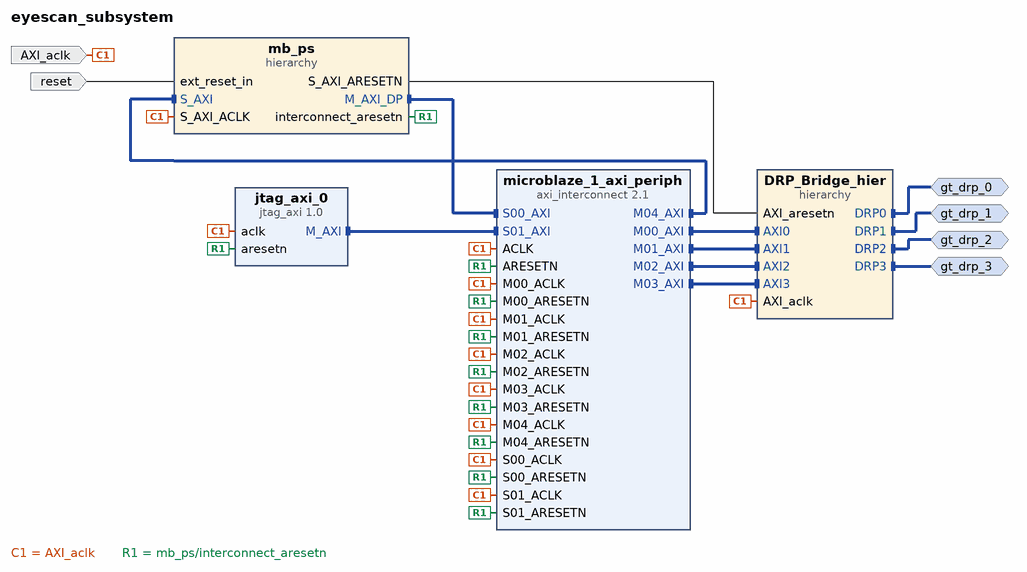
[diagram p0: block diagram of the top level]
# Vivado block design eyescan_subsystem, Vivado 2014.4
create_bd_design eyescan_subsystem

create_bd_intf_port -mode Master -vlnv xilinx.com:interface:drp_rtl:1.0 gt_drp_0
create_bd_intf_port -mode Master -vlnv xilinx.com:interface:drp_rtl:1.0 gt_drp_1
create_bd_intf_port -mode Master -vlnv xilinx.com:interface:drp_rtl:1.0 gt_drp_2
create_bd_intf_port -mode Master -vlnv xilinx.com:interface:drp_rtl:1.0 gt_drp_3
create_bd_port -dir I AXI_aclk
create_bd_port -dir I -type rst reset
set_property -dict {CONFIG.POLARITY ACTIVE_HIGH} [get_bd_ports reset]

create_bd_cell -type hier DRP_Bridge_hier
create_bd_cell -type hier mb_ps
create_bd_cell -type ip -vlnv xilinx.com:ip:jtag_axi:1.0 jtag_axi_0
create_bd_cell -type ip -vlnv xilinx.com:ip:axi_interconnect:2.1 microblaze_1_axi_periph
set_property -dict {CONFIG.NUM_SI 2 CONFIG.NUM_MI 5 CONFIG.STRATEGY 1} [get_bd_cells microblaze_1_axi_periph]

# ---- hierarchy /DRP_Bridge_hier ----
current_bd_instance /DRP_Bridge_hier
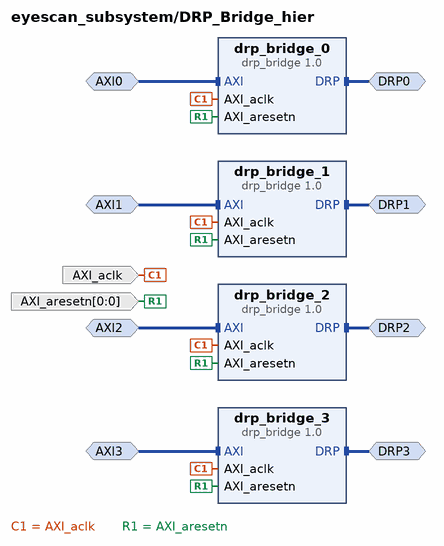
[diagram p1: block diagram inside /DRP_Bridge_hier]
create_bd_intf_pin -mode Slave -vlnv xilinx.com:interface:aximm_rtl:1.0 AXI0
create_bd_intf_pin -mode Slave -vlnv xilinx.com:interface:aximm_rtl:1.0 AXI1
create_bd_intf_pin -mode Slave -vlnv xilinx.com:interface:aximm_rtl:1.0 AXI2
create_bd_intf_pin -mode Slave -vlnv xilinx.com:interface:aximm_rtl:1.0 AXI3
create_bd_intf_pin -mode Master -vlnv xilinx.com:interface:drp_rtl:1.0 DRP0
create_bd_intf_pin -mode Master -vlnv xilinx.com:interface:drp_rtl:1.0 DRP1
create_bd_intf_pin -mode Master -vlnv xilinx.com:interface:drp_rtl:1.0 DRP2
create_bd_intf_pin -mode Master -vlnv xilinx.com:interface:drp_rtl:1.0 DRP3
create_bd_pin -dir I -type clk AXI_aclk
create_bd_pin -dir I -from 0 -to 0 -type rst AXI_aresetn

create_bd_cell -type ip -vlnv xilinx.com:ip:drp_bridge:1.0 drp_bridge_0
set_property -dict {CONFIG.C_S_AXI_ADDR_WIDTH 24} [get_bd_cells drp_bridge_0]
create_bd_cell -type ip -vlnv xilinx.com:ip:drp_bridge:1.0 drp_bridge_1
set_property -dict {CONFIG.C_S_AXI_ADDR_WIDTH 24} [get_bd_cells drp_bridge_1]
create_bd_cell -type ip -vlnv xilinx.com:ip:drp_bridge:1.0 drp_bridge_2
set_property -dict {CONFIG.C_S_AXI_ADDR_WIDTH 24} [get_bd_cells drp_bridge_2]
create_bd_cell -type ip -vlnv xilinx.com:ip:drp_bridge:1.0 drp_bridge_3
set_property -dict {CONFIG.C_S_AXI_ADDR_WIDTH 24} [get_bd_cells drp_bridge_3]

# ---- hierarchy /mb_ps ----
current_bd_instance /mb_ps
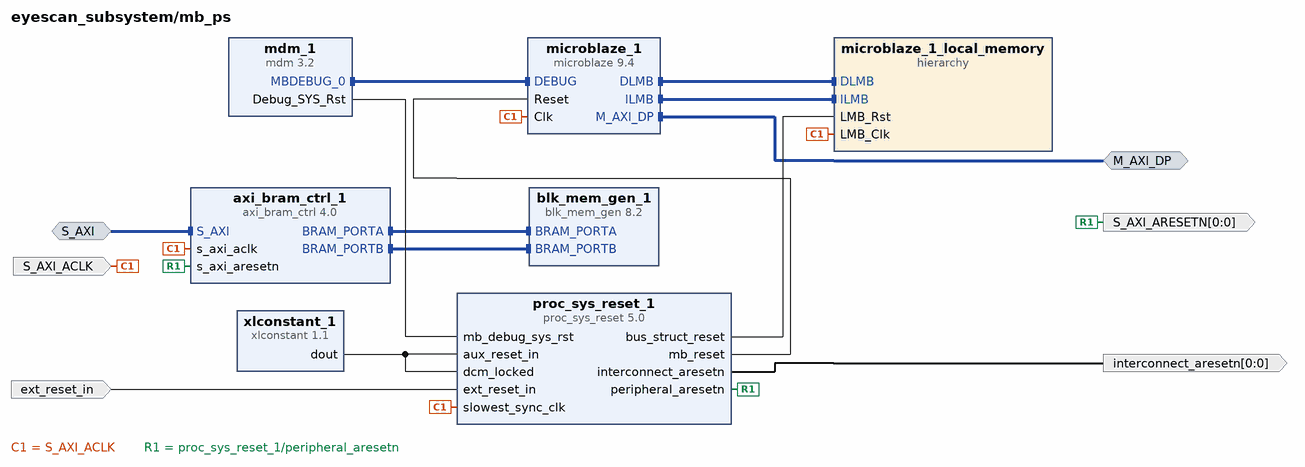
[diagram p2: block diagram inside /mb_ps]
create_bd_intf_pin -mode Master -vlnv xilinx.com:interface:aximm_rtl:1.0 M_AXI_DP
create_bd_intf_pin -mode Slave -vlnv xilinx.com:interface:aximm_rtl:1.0 S_AXI
create_bd_pin -dir I -type clk S_AXI_ACLK
create_bd_pin -dir O -from 0 -to 0 -type rst S_AXI_ARESETN
create_bd_pin -dir I -type rst ext_reset_in
create_bd_pin -dir O -from 0 -to 0 -type rst interconnect_aresetn

create_bd_cell -type hier microblaze_1_local_memory
create_bd_cell -type ip -vlnv xilinx.com:ip:axi_bram_ctrl:4.0 axi_bram_ctrl_1
set_property -dict {CONFIG.SUPPORTS_NARROW_BURST 0} [get_bd_cells axi_bram_ctrl_1]
create_bd_cell -type ip -vlnv xilinx.com:ip:blk_mem_gen:8.2 blk_mem_gen_1
set_property -dict [list \
  CONFIG.Memory_Type True_Dual_Port_RAM \
  CONFIG.Enable_32bit_Address true \
  CONFIG.Enable_B Use_ENB_Pin \
  CONFIG.Register_PortA_Output_of_Memory_Primitives false \
  CONFIG.Use_RSTA_Pin true \
  CONFIG.Use_RSTB_Pin true \
  CONFIG.Port_B_Clock 100 \
  CONFIG.Port_B_Write_Rate 50 \
  CONFIG.Port_B_Enable_Rate 100 \
  CONFIG.use_bram_block BRAM_Controller \
] [get_bd_cells blk_mem_gen_1]
create_bd_cell -type ip -vlnv xilinx.com:ip:mdm:3.2 mdm_1
create_bd_cell -type ip -vlnv xilinx.com:ip:microblaze:9.4 microblaze_1
set_property -dict [list \
  CONFIG.C_FREQ 100000000 \
  CONFIG.C_FAULT_TOLERANT 0 \
  CONFIG.C_AREA_OPTIMIZED 1 \
  CONFIG.C_D_AXI 1 \
  CONFIG.C_D_LMB 1 \
  CONFIG.C_I_LMB 1 \
  CONFIG.C_M_AXI_DC_USER_SIGNALS 0 \
  CONFIG.C_M_AXI_IC_USER_SIGNALS 0 \
  CONFIG.G_TEMPLATE_LIST 1 \
  CONFIG.C_USE_REORDER_INSTR 0 \
  CONFIG.C_DEBUG_ENABLED 1 \
  CONFIG.C_NUMBER_OF_PC_BRK 0 \
  CONFIG.C_USE_INTERRUPT 0 \
  CONFIG.C_USE_EXT_BRK 0 \
  CONFIG.C_USE_EXT_NM_BRK 0 \
] [get_bd_cells microblaze_1]
create_bd_cell -type ip -vlnv xilinx.com:ip:proc_sys_reset:5.0 proc_sys_reset_1
set_property -dict {CONFIG.C_AUX_RESET_HIGH 0 CONFIG.USE_BOARD_FLOW false} [get_bd_cells proc_sys_reset_1]
create_bd_cell -type ip -vlnv xilinx.com:ip:xlconstant:1.1 xlconstant_1

# ---- hierarchy /mb_ps/microblaze_1_local_memory ----
current_bd_instance /mb_ps/microblaze_1_local_memory
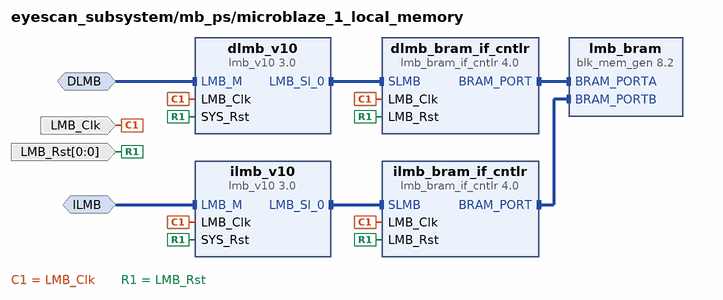
[diagram p3: block diagram inside /mb_ps/microblaze_1_local_memory]
create_bd_intf_pin -mode MirroredMaster -vlnv xilinx.com:interface:lmb_rtl:1.0 DLMB
create_bd_intf_pin -mode MirroredMaster -vlnv xilinx.com:interface:lmb_rtl:1.0 ILMB
create_bd_pin -dir I LMB_Clk
create_bd_pin -dir I -from 0 -to 0 LMB_Rst

create_bd_cell -type ip -vlnv xilinx.com:ip:lmb_bram_if_cntlr:4.0 dlmb_bram_if_cntlr
set_property -dict {CONFIG.C_MASK 0x40000000 CONFIG.C_ECC 0} [get_bd_cells dlmb_bram_if_cntlr]
create_bd_cell -type ip -vlnv xilinx.com:ip:lmb_v10:3.0 dlmb_v10
create_bd_cell -type ip -vlnv xilinx.com:ip:lmb_bram_if_cntlr:4.0 ilmb_bram_if_cntlr
set_property -dict {CONFIG.C_MASK 0x00000000 CONFIG.C_ECC 0} [get_bd_cells ilmb_bram_if_cntlr]
create_bd_cell -type ip -vlnv xilinx.com:ip:lmb_v10:3.0 ilmb_v10
create_bd_cell -type ip -vlnv xilinx.com:ip:blk_mem_gen:8.2 lmb_bram
set_property -dict [list \
  CONFIG.Memory_Type True_Dual_Port_RAM \
  CONFIG.Enable_32bit_Address true \
  CONFIG.Enable_B Use_ENB_Pin \
  CONFIG.Register_PortA_Output_of_Memory_Primitives false \
  CONFIG.Use_RSTA_Pin true \
  CONFIG.Use_RSTB_Pin true \
  CONFIG.Port_B_Clock 100 \
  CONFIG.Port_B_Write_Rate 50 \
  CONFIG.Port_B_Enable_Rate 100 \
  CONFIG.use_bram_block BRAM_Controller \
] [get_bd_cells lmb_bram]

# ---- connections ----

current_bd_instance /DRP_Bridge_hier
connect_bd_intf_net [get_bd_intf_pins AXI0] [get_bd_intf_pins drp_bridge_0/AXI]
connect_bd_intf_net [get_bd_intf_pins AXI1] [get_bd_intf_pins drp_bridge_1/AXI]
connect_bd_intf_net [get_bd_intf_pins AXI2] [get_bd_intf_pins drp_bridge_2/AXI]
connect_bd_intf_net [get_bd_intf_pins AXI3] [get_bd_intf_pins drp_bridge_3/AXI]
connect_bd_intf_net -intf_net drp_mux_1_gt_drp [get_bd_intf_pins DRP0] [get_bd_intf_pins drp_bridge_0/DRP]
connect_bd_intf_net -intf_net drp_mux_2_gt_drp [get_bd_intf_pins DRP1] [get_bd_intf_pins drp_bridge_1/DRP]
connect_bd_intf_net -intf_net drp_mux_3_gt_drp [get_bd_intf_pins DRP2] [get_bd_intf_pins drp_bridge_2/DRP]
connect_bd_intf_net -intf_net drp_bridge_4_drp [get_bd_intf_pins DRP3] [get_bd_intf_pins drp_bridge_3/DRP]
connect_bd_net [get_bd_pins AXI_aclk] \
  [get_bd_pins drp_bridge_0/AXI_aclk] [get_bd_pins drp_bridge_1/AXI_aclk] [get_bd_pins drp_bridge_2/AXI_aclk] \
  [get_bd_pins drp_bridge_3/AXI_aclk]
connect_bd_net -net proc_sys_reset_1_peripheral_aresetn [get_bd_pins AXI_aresetn] \
  [get_bd_pins drp_bridge_0/AXI_aresetn] [get_bd_pins drp_bridge_1/AXI_aresetn] [get_bd_pins drp_bridge_2/AXI_aresetn] \
  [get_bd_pins drp_bridge_3/AXI_aresetn]

current_bd_instance /mb_ps
connect_bd_intf_net [get_bd_intf_pins axi_bram_ctrl_1/BRAM_PORTA] [get_bd_intf_pins blk_mem_gen_1/BRAM_PORTA]
connect_bd_intf_net [get_bd_intf_pins axi_bram_ctrl_1/BRAM_PORTB] [get_bd_intf_pins blk_mem_gen_1/BRAM_PORTB]
connect_bd_intf_net [get_bd_intf_pins mdm_1/MBDEBUG_0] [get_bd_intf_pins microblaze_1/DEBUG]
connect_bd_intf_net [get_bd_intf_pins microblaze_1/DLMB] [get_bd_intf_pins microblaze_1_local_memory/DLMB]
connect_bd_intf_net [get_bd_intf_pins microblaze_1/ILMB] [get_bd_intf_pins microblaze_1_local_memory/ILMB]
connect_bd_intf_net -intf_net microblaze_1_axi_dp [get_bd_intf_pins M_AXI_DP] [get_bd_intf_pins microblaze_1/M_AXI_DP]
connect_bd_intf_net [get_bd_intf_pins S_AXI] [get_bd_intf_pins axi_bram_ctrl_1/S_AXI]
connect_bd_net -net axi_aclk_1 [get_bd_pins S_AXI_ACLK] \
  [get_bd_pins microblaze_1_local_memory/LMB_Clk] [get_bd_pins axi_bram_ctrl_1/s_axi_aclk] [get_bd_pins microblaze_1/Clk] \
  [get_bd_pins proc_sys_reset_1/slowest_sync_clk]
connect_bd_net -net m07_aresetn_1 [get_bd_pins proc_sys_reset_1/interconnect_aresetn] [get_bd_pins interconnect_aresetn]
connect_bd_net [get_bd_pins mdm_1/Debug_SYS_Rst] [get_bd_pins proc_sys_reset_1/mb_debug_sys_rst]
connect_bd_net [get_bd_pins proc_sys_reset_1/bus_struct_reset] [get_bd_pins microblaze_1_local_memory/LMB_Rst]
connect_bd_net [get_bd_pins proc_sys_reset_1/mb_reset] [get_bd_pins microblaze_1/Reset]
connect_bd_net [get_bd_pins proc_sys_reset_1/peripheral_aresetn] [get_bd_pins S_AXI_ARESETN] [get_bd_pins axi_bram_ctrl_1/s_axi_aresetn]
connect_bd_net -net reset_1 [get_bd_pins ext_reset_in] [get_bd_pins proc_sys_reset_1/ext_reset_in]
connect_bd_net -net xlconstant_1_const [get_bd_pins xlconstant_1/dout] \
  [get_bd_pins proc_sys_reset_1/aux_reset_in] [get_bd_pins proc_sys_reset_1/dcm_locked]

current_bd_instance /mb_ps/microblaze_1_local_memory
connect_bd_intf_net -intf_net microblaze_1_dlmb_bus [get_bd_intf_pins dlmb_bram_if_cntlr/SLMB] [get_bd_intf_pins dlmb_v10/LMB_Sl_0]
connect_bd_intf_net -intf_net microblaze_1_dlmb_cntlr [get_bd_intf_pins dlmb_bram_if_cntlr/BRAM_PORT] [get_bd_intf_pins lmb_bram/BRAM_PORTA]
connect_bd_intf_net -intf_net microblaze_1_ilmb_bus [get_bd_intf_pins ilmb_bram_if_cntlr/SLMB] [get_bd_intf_pins ilmb_v10/LMB_Sl_0]
connect_bd_intf_net -intf_net microblaze_1_ilmb_cntlr [get_bd_intf_pins ilmb_bram_if_cntlr/BRAM_PORT] [get_bd_intf_pins lmb_bram/BRAM_PORTB]
connect_bd_intf_net -intf_net microblaze_1_dlmb [get_bd_intf_pins DLMB] [get_bd_intf_pins dlmb_v10/LMB_M]
connect_bd_intf_net -intf_net microblaze_1_ilmb [get_bd_intf_pins ILMB] [get_bd_intf_pins ilmb_v10/LMB_M]
connect_bd_net -net microblaze_1_Clk [get_bd_pins LMB_Clk] \
  [get_bd_pins dlmb_bram_if_cntlr/LMB_Clk] [get_bd_pins dlmb_v10/LMB_Clk] [get_bd_pins ilmb_bram_if_cntlr/LMB_Clk] \
  [get_bd_pins ilmb_v10/LMB_Clk]
connect_bd_net -net proc_sys_reset_1_bus_struct_reset [get_bd_pins LMB_Rst] \
  [get_bd_pins dlmb_bram_if_cntlr/LMB_Rst] [get_bd_pins dlmb_v10/SYS_Rst] [get_bd_pins ilmb_bram_if_cntlr/LMB_Rst] \
  [get_bd_pins ilmb_v10/SYS_Rst]

current_bd_instance /
connect_bd_intf_net [get_bd_intf_pins jtag_axi_0/M_AXI] [get_bd_intf_pins microblaze_1_axi_periph/S01_AXI]
connect_bd_intf_net -intf_net microblaze_1_axi_dp [get_bd_intf_pins mb_ps/M_AXI_DP] [get_bd_intf_pins microblaze_1_axi_periph/S00_AXI]
connect_bd_intf_net -intf_net AXI0_1 [get_bd_intf_pins DRP_Bridge_hier/AXI0] [get_bd_intf_pins microblaze_1_axi_periph/M00_AXI]
connect_bd_intf_net -intf_net AXI1_1 [get_bd_intf_pins DRP_Bridge_hier/AXI1] [get_bd_intf_pins microblaze_1_axi_periph/M01_AXI]
connect_bd_intf_net -intf_net AXI2_1 [get_bd_intf_pins DRP_Bridge_hier/AXI2] [get_bd_intf_pins microblaze_1_axi_periph/M02_AXI]
connect_bd_intf_net -intf_net AXI3_1 [get_bd_intf_pins DRP_Bridge_hier/AXI3] [get_bd_intf_pins microblaze_1_axi_periph/M03_AXI]
connect_bd_intf_net [get_bd_intf_pins microblaze_1_axi_periph/M04_AXI] [get_bd_intf_pins mb_ps/S_AXI]
connect_bd_intf_net -intf_net drp_mux_1_gt_drp [get_bd_intf_ports gt_drp_0] [get_bd_intf_pins DRP_Bridge_hier/DRP0]
connect_bd_intf_net -intf_net drp_mux_2_gt_drp [get_bd_intf_ports gt_drp_1] [get_bd_intf_pins DRP_Bridge_hier/DRP1]
connect_bd_intf_net -intf_net drp_mux_3_gt_drp [get_bd_intf_ports gt_drp_2] [get_bd_intf_pins DRP_Bridge_hier/DRP2]
connect_bd_intf_net -intf_net drp_bridge_4_drp [get_bd_intf_ports gt_drp_3] [get_bd_intf_pins DRP_Bridge_hier/DRP3]
connect_bd_net [get_bd_ports AXI_aclk] \
  [get_bd_pins DRP_Bridge_hier/AXI_aclk] [get_bd_pins mb_ps/S_AXI_ACLK] [get_bd_pins jtag_axi_0/aclk] \
  [get_bd_pins microblaze_1_axi_periph/ACLK] [get_bd_pins microblaze_1_axi_periph/S00_ACLK] \
  [get_bd_pins microblaze_1_axi_periph/M00_ACLK] [get_bd_pins microblaze_1_axi_periph/M01_ACLK] \
  [get_bd_pins microblaze_1_axi_periph/S01_ACLK] [get_bd_pins microblaze_1_axi_periph/M02_ACLK] \
  [get_bd_pins microblaze_1_axi_periph/M03_ACLK] [get_bd_pins microblaze_1_axi_periph/M04_ACLK]
connect_bd_net -net m07_aresetn_1 [get_bd_pins mb_ps/interconnect_aresetn] \
  [get_bd_pins jtag_axi_0/aresetn] [get_bd_pins microblaze_1_axi_periph/ARESETN] \
  [get_bd_pins microblaze_1_axi_periph/S00_ARESETN] [get_bd_pins microblaze_1_axi_periph/M00_ARESETN] \
  [get_bd_pins microblaze_1_axi_periph/M01_ARESETN] [get_bd_pins microblaze_1_axi_periph/S01_ARESETN] \
  [get_bd_pins microblaze_1_axi_periph/M02_ARESETN] [get_bd_pins microblaze_1_axi_periph/M03_ARESETN] \
  [get_bd_pins microblaze_1_axi_periph/M04_ARESETN]
connect_bd_net -net proc_sys_reset_1_peripheral_aresetn [get_bd_pins mb_ps/S_AXI_ARESETN] [get_bd_pins DRP_Bridge_hier/AXI_aresetn]
connect_bd_net [get_bd_ports reset] [get_bd_pins mb_ps/ext_reset_in]

# ---- address map ----
assign_bd_address -offset 0xC0000000 -range 4K -target_address_space [get_bd_addr_spaces jtag_axi_0/Data] [get_bd_addr_segs DRP_Bridge_hier/drp_bridge_0/AXI/reg0]
assign_bd_address -offset 0xC0001000 -range 4K -target_address_space [get_bd_addr_spaces jtag_axi_0/Data] [get_bd_addr_segs DRP_Bridge_hier/drp_bridge_1/AXI/reg0]
assign_bd_address -offset 0xC0002000 -range 4K -target_address_space [get_bd_addr_spaces jtag_axi_0/Data] [get_bd_addr_segs DRP_Bridge_hier/drp_bridge_2/AXI/reg0]
assign_bd_address -offset 0xC0003000 -range 4K -target_address_space [get_bd_addr_spaces jtag_axi_0/Data] [get_bd_addr_segs DRP_Bridge_hier/drp_bridge_3/AXI/reg0]
assign_bd_address -offset 0xC2000000 -range 16K -target_address_space [get_bd_addr_spaces jtag_axi_0/Data] [get_bd_addr_segs mb_ps/axi_bram_ctrl_1/S_AXI/Mem0]
assign_bd_address -offset 0x0 -range 16K -target_address_space [get_bd_addr_spaces mb_ps/microblaze_1/Data] [get_bd_addr_segs mb_ps/microblaze_1_local_memory/dlmb_bram_if_cntlr/SLMB/Mem]
assign_bd_address -offset 0xC0000000 -range 4K -target_address_space [get_bd_addr_spaces mb_ps/microblaze_1/Data] [get_bd_addr_segs DRP_Bridge_hier/drp_bridge_0/AXI/reg0]
assign_bd_address -offset 0xC0001000 -range 4K -target_address_space [get_bd_addr_spaces mb_ps/microblaze_1/Data] [get_bd_addr_segs DRP_Bridge_hier/drp_bridge_1/AXI/reg0]
assign_bd_address -offset 0xC0002000 -range 4K -target_address_space [get_bd_addr_spaces mb_ps/microblaze_1/Data] [get_bd_addr_segs DRP_Bridge_hier/drp_bridge_2/AXI/reg0]
assign_bd_address -offset 0xC0003000 -range 4K -target_address_space [get_bd_addr_spaces mb_ps/microblaze_1/Data] [get_bd_addr_segs DRP_Bridge_hier/drp_bridge_3/AXI/reg0]
assign_bd_address -offset 0xC2000000 -range 16K -target_address_space [get_bd_addr_spaces mb_ps/microblaze_1/Data] [get_bd_addr_segs mb_ps/axi_bram_ctrl_1/S_AXI/Mem0]
assign_bd_address -offset 0x0 -range 16K -target_address_space [get_bd_addr_spaces mb_ps/microblaze_1/Instruction] [get_bd_addr_segs mb_ps/microblaze_1_local_memory/ilmb_bram_if_cntlr/SLMB/Mem]

validate_bd_design
save_bd_design
